# EAGLE design controller v2 (EAGLE 6.4)
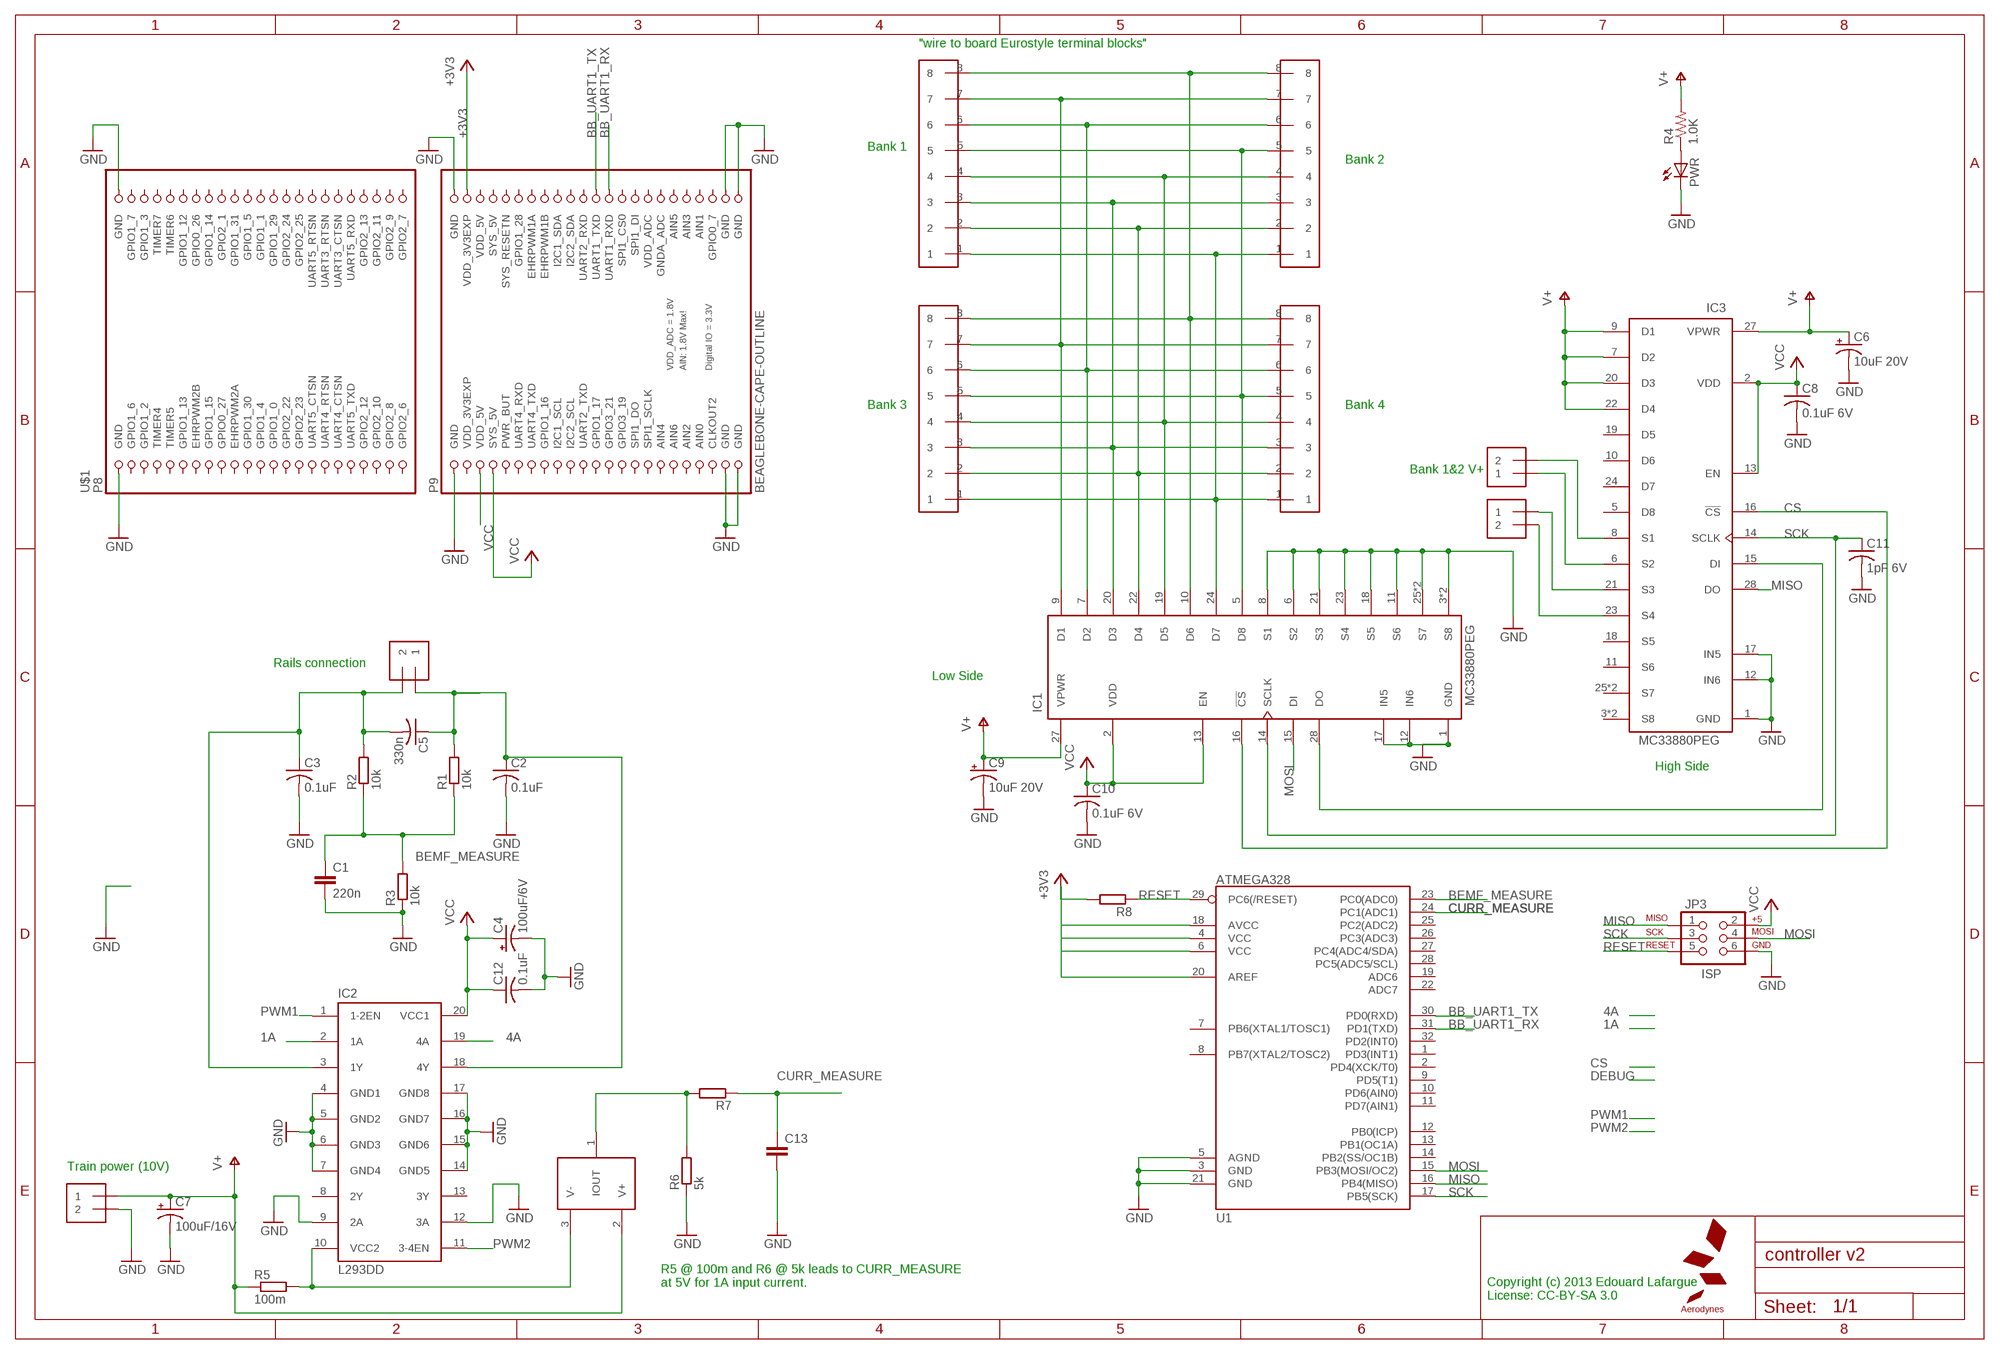
[diagram p0: schematic, sheet 1]

## Parts
BANK12  1X2-3.5MM  [1X2-3.5MM]
BANK34  1X2-3.5MM  [1X2-3.5MM]
C1  220n  C-EUC0805  [C0805]
C2  0.1uF  C-US025-025X050  [C025-025X050]
C3  0.1uF  C-US025-025X050  [C025-025X050]
C4  100uF/6V  CPOL-USE2.5-5  [E2,5-5]
C5  330n  C-US050-025X075  [C050-025X075]
C6  10uF 20V  CPOL-USE2,5-6E  [E2,5-6E]
C7  100uF/16V  CPOL-USE2.5-6  [E2,5-6]
C8  0.1uF 6V  C-US025-025X050  [C025-025X050]
C9  10uF 20V  CPOL-USE2,5-6E  [E2,5-6E]
C10  0.1uF 6V  C-US025-025X050  [C025-025X050]
C11  1pF 6V  C-USC0805K  [C0805K]
C12  0.1uF  C-US025-025X050  [C025-025X050]
C13  C-EUC0805K  [C0805K]
CON1  1X08-CONN3.5MM  [1X08-3.5MM]
CON2  1X08-CONN3.5MM  [1X08-3.5MM]
CON3  1X08-CONN3.5MM  [1X08-3.5MM]
CON4  1X08-CONN3.5MM  [1X08-3.5MM]
IC1  MC33880PEG  [SO28W]
IC2  L293DD  [SOIC20-2]
IC3  MC33880PEG  [SO28W]
JP3  ISP  AVR_SPI_PRG_6PTH  [2X3]
PWR  LED3MM  [LED3MM]
R1  10k  R-EU_R0805  [R0805]
R2  10k  R-EU_R0805  [R0805]
R3  10k  R-EU_R0805  [R0805]
R4  1.0K  R-US_M0805  [M0805]
R5  100m  R-EU_M1206  [M1206]
R6  5k  R-EU_R0603  [R0603]
R7  R-EU_R0603  [R0603]
R8  R-EU_R0603  [R0603]
SL1  1X2-3.5MM  [1X2-3.5MM]
SL2  1X2-3.5MM  [1X2-3.5MM]
U1  ATMEGA328  ATMEGA168  [TQFP32-08]
U$1  BEAGLEBONE-CAPE-OUTLINE  [BEAGLEBONE_NOCUT]
U$2  LOGO-AERODYNESSMALL  [LOGO-AERODYNES-S]
U$3  ZXCT1009-F  [SOT23-1TOP]

## Nets
1A: IC2.2(1A)
1Y: C3.1 C5.2 IC2.3(1Y) R2.2 SL1.2
4A: IC2.19(4A)
4Y: C2.1 C5.1 IC2.18(4Y) R1.2 SL1.1
+3V3: R8.2 U1.4(VCC) U1.6(VCC) U1.18(AVCC) U1.20(AREF) U$1.P9-4(VDD_3V3EXP)
BB_UART1_RX: U1.31(PD1(TXD)) U$1.P9-26(UART1_RXD)
BB_UART1_TX: U1.30(PD0(RXD)) U$1.P9-24(UART1_TXD)
BEMF_MEASURE: C1.1 R1.1 R2.1 R3.2 U1.23(PC0(ADC0))
CS: IC1.16(!CS) IC3.16(!CS)
CURR_MEASURE: C13.1 R7.1 U1.24(PC1(ADC1))
GND: C1.2 C2.2 C3.2 C4.- C6.- C7.- C8.2 C9.- C10.2 C11.2 C12.2 C13.2 IC1.1(GND) IC1.3(S8) IC1.4(S8) IC1.6(S2) IC1.8(S1) IC1.11(S6) IC1.12(IN6) IC1.17(IN5) IC1.18(S5) IC1.21(S3) IC1.23(S4) IC1.25(S7) IC1.26(S7) IC2.4(GND1) IC2.5(GND2) IC2.6(GND3) IC2.7(GND4) IC2.9(2A) IC2.12(3A) IC2.14(GND5) IC2.15(GND6) IC2.16(GND7) IC2.17(GND8) IC3.1(GND) IC3.12(IN6) IC3.17(IN5) JP3.6 PWR.K(C) R3.1 R6.1 SL2.2 U1.3(GND) U1.5(AGND) U1.21(GND) U$1.P8-1(GND) U$1.P8-2(GND) U$1.P9-1(GND) U$1.P9-2(GND) U$1.P9-43(GND) U$1.P9-44(GND) U$1.P9-45(GND) U$1.P9-46(GND)
MISO: IC3.28(DO) JP3.1 U1.16(PB4(MISO))
MOSI: IC1.15(DI) JP3.4 U1.15(PB3(MOSI/OC2))
N$1: BANK34.2 IC3.23(S4)
N$2: BANK34.1 IC3.21(S3)
N$3: BANK12.1 IC3.6(S2)
N$4: BANK12.2 IC3.8(S1)
N$5: IC2.10(VCC2) R5.2 U$3.3(V-)
N$6: R6.2 R7.2 U$3.1(IOUT)
N$7: CON1.3 CON2.3 CON3.3 CON4.3 IC1.20(D3)
N$8: CON1.4 CON2.4 CON3.4 CON4.4 IC1.19(D5)
N$9: CON1.5 CON2.5 CON3.5 CON4.5 IC1.5(D8)
N$11: CON1.1 CON2.1 CON3.1 CON4.1 IC1.24(D7)
N$12: CON1.8 CON2.8 CON3.8 CON4.8 IC1.10(D6)
N$13: IC1.28(DO) IC3.15(DI)
N$14: CON1.7 CON2.7 CON3.7 CON4.7 IC1.9(D1)
N$15: CON1.2 CON2.2 CON3.2 CON4.2 IC1.22(D4)
N$16: CON1.6 CON2.6 CON3.6 CON4.6 IC1.7(D2)
N$17: U$1.P9-5(VDD_5V)
N$35: PWR.A R4.1
PWM1: IC2.1(1-2EN)
PWM2: IC2.11(3-4EN)
RESET: JP3.5 R8.1 U1.29(PC6(/RESET))
SCK: C11.1 IC1.14(SCLK) IC3.14(SCLK) JP3.3 U1.17(PB5(SCK))
SYS_5V: C4.+ C8.1 C10.1 C12.1 IC1.2(VDD) IC1.13(EN) IC2.20(VCC1) IC3.2(VDD) IC3.13(EN) JP3.2 ; supply symbol labelled VCC
V+: C6.+ C7.+ C9.+ IC1.27(VPWR) IC3.7(D2) IC3.9(D1) IC3.20(D3) IC3.22(D4) IC3.27(VPWR) R4.2 R5.1 SL2.1 U$3.2(V+)
VCC: U$1.P9-7(SYS_5V)
Unconnected: IC2.8(2Y) IC2.13(3Y) IC3.3(S8) IC3.4(S8) IC3.5(D8) IC3.10(D6) IC3.11(S6) IC3.18(S5) IC3.19(D5) IC3.24(D7) IC3.25(S7) IC3.26(S7) U1.1(PD3(INT1)) U1.2(PD4(XCK/T0)) U1.7(PB6(XTAL1/TOSC1)) U1.8(PB7(XTAL2/TOSC2)) U1.9(PD5(T1)) U1.10(PD6(AIN0)) U1.11(PD7(AIN1)) U1.12(PB0(ICP)) U1.13(PB1(OC1A)) U1.14(PB2(SS/OC1B)) U1.19(ADC6) U1.22(ADC7) U1.25(PC2(ADC2)) U1.26(PC3(ADC3)) U1.27(PC4(ADC4/SDA)) U1.28(PC5(ADC5/SCL)) U1.32(PD2(INT0)) U$1.P8-3(GPIO1_6) U$1.P8-4(GPIO1_7) U$1.P8-5(GPIO1_2) U$1.P8-6(GPIO1_3) U$1.P8-7(TIMER4) U$1.P8-8(TIMER7) U$1.P8-9(TIMER5) U$1.P8-10(TIMER6) U$1.P8-11(GPIO1_13) U$1.P8-12(GPIO1_12) U$1.P8-13(EHRPWM2B) U$1.P8-14(GPIO0_26) U$1.P8-15(GPIO1_15) U$1.P8-16(GPIO1_14) U$1.P8-17(GPIO0_27) U$1.P8-18(GPIO2_1) U$1.P8-19(EHRPWM2A) U$1.P8-20(GPIO1_31) U$1.P8-21(GPIO1_30) U$1.P8-22(GPIO1_5) U$1.P8-23(GPIO1_4) U$1.P8-24(GPIO1_1) U$1.P8-25(GPIO1_0) U$1.P8-26(GPIO1_29) U$1.P8-27(GPIO2_22) U$1.P8-28(GPIO2_24) U$1.P8-29(GPIO2_23) U$1.P8-30(GPIO2_25) U$1.P8-31(UART5_CTSN) U$1.P8-32(UART5_RTSN) U$1.P8-33(UART4_RTSN) U$1.P8-34(UART3_RTSN) U$1.P8-35(UART4_CTSN) U$1.P8-36(UART3_CTSN) U$1.P8-37(UART5_TXD) U$1.P8-38(UART5_RXD) U$1.P8-39(GPIO2_12) U$1.P8-40(GPIO2_13) U$1.P8-41(GPIO2_10) U$1.P8-42(GPIO2_11) U$1.P8-43(GPIO2_8) U$1.P8-44(GPIO2_9) U$1.P8-45(GPIO2_6) U$1.P8-46(GPIO2_7) U$1.P9-9(PWR_BUT) U$1.P9-10(SYS_RESETN) U$1.P9-11(UART4_RXD) U$1.P9-12(GPIO1_28) U$1.P9-13(UART4_TXD) U$1.P9-14(EHRPWM1A) U$1.P9-15(GPIO1_16) U$1.P9-16(EHRPWM1B) U$1.P9-17(I2C1_SCL) U$1.P9-18(I2C1_SDA) U$1.P9-19(I2C2_SCL) U$1.P9-20(I2C2_SDA) U$1.P9-21(UART2_TXD) U$1.P9-22(UART2_RXD) U$1.P9-23(GPIO1_17) U$1.P9-25(GPIO3_21) U$1.P9-27(GPIO3_19) U$1.P9-28(SPI1_CS0) U$1.P9-29(SPI1_DO) U$1.P9-30(SPI1_DI) U$1.P9-31(SPI1_SCLK) U$1.P9-33(AIN4) U$1.P9-35(AIN6) U$1.P9-36(AIN5) U$1.P9-37(AIN2) U$1.P9-38(AIN3) U$1.P9-39(AIN0) U$1.P9-40(AIN1) U$1.P9-41(CLKOUT2) U$1.P9-42(GPIO0_7)

## Notes on the sheet
- "wire to board Eurostyle terminal blocks"
- Bank 1
- Bank 2
- Bank 3 | Bank 4
- Bank 1&2 V+
- Rails connection
- Low Side
- High Side
- Train power (10V)
- R5 @ 100m and R6 @ 5k leads to CURR_MEASURE
  at 5V for 1A input current.
- Copyright (c) 2013 Edouard Lafargue
  License: CC-BY-SA 3.0

## Power pins joined to a net without a drawn wire
GNDA_ADC: U$1.P9-34(GNDA_ADC)
SYS_5V: U$1.P9-8(SYS_5V)
VDD_3V3EXP: U$1.P9-3(VDD_3V3EXP)
VDD_5V: U$1.P9-6(VDD_5V)
VDD_ADC: U$1.P9-32(VDD_ADC)

## Library data of the parts
BANK12 BANK34 SL1 SL2 = adafruit:1X2: 3.5mm Terminal block http://www.ladyada.net/library/pcb/eaglelibrary.html
C1 C13 = resistor:C-EU: CAPACITOR, European symbol
C2 C3 C8 C10-C12 = rcl-ez:C-US: CAPACITOR, American symbol
C4 = adafruit:CPOL-US: POLARIZED CAPACITOR, American symbol
C5 = adafruit:C-US: CAPACITOR, American symbol
C6 C9 = rcl:CPOL-US: POLARIZED CAPACITOR, American symbol
C7 = rcl-ez:CPOL-US: POLARIZED CAPACITOR, American symbol
CON1-CON4 = aerodynes:1X08-CONN: Generic 3.5mm pitch screw connector, 8 plots.
IC1 IC3 = aerodynes:MC33880: Freescale 33880 The 33880 device is an 8-output hardware configurable high side/ low side switch with 8-bit serial input control using the serial peripheral interface (SPI). Two of the outputs can be controlled directly via microcontroller for pulse-width modulation (PWM) applications. The 33880 controls various inductive or incandescent loads by directly interfacing with a microcontroller. The circuit's innovative monitoring and protection features include very low standby currents, “cascadable” fault reporting, internal 40 V output clamping for low side configurations, internal -20 V output clamping for high side configurations, output specific diagnostics, and independent shutdown of outputs.
IC2 = aerodynes:L293D: The Device is a monolithic integrated high voltage, high current four channel driver designed to accept standard DTL or TTL logic levels and drive inductive loads (such as relays solenoides, DC and stepping motors) and switching power transistors. To simplify use as two bridges each pair of channels is equipped with an enable input. A separate supply input is provided for the logic, allowing operation at a lower voltage and internal clamp diodes are included. This device is suitable for use in switching applications at frequencies up to 5 kHz.
JP3 = SparkFun:AVR_SPI_PRG_6: AVR ISP 6 Pin This is the reduced ISP connector for AVR programming. Common on Arduino. This footprint will take up less PCB space and can be used with a 10-pin to 6-pin adapter such as SKU: BOB-08508
PWR = minimidi:LED: LED OSRAM: - CHIPLED LG R971, LG N971, LY N971, LG Q971, LY Q971, LO R971, LY R971 LH N974, LH R974 LS Q976, LO Q976, LY Q976 LO Q996 - Hyper CHIPLED LW Q18S LB Q993, LB Q99A, LB R99A - SideLED LS A670, LO A670, LY A670, LG A670, LP A670 LB A673, LV A673, LT A673, LW A673 LH A674 LY A675 LS A676, LA A676, LO A676, LY A676, LW A676 LS A679, LY A679, LG A679 - Hyper Micro SIDELED® LS Y876, LA Y876, LO Y876, LY Y876 LT Y87S - SmartLED LW L88C, LW L88S LB L89C, LB L89S, LG L890 LS L89K, LO L89K, LY L89K LS L896, LA L896, LO L896, LY L896 - TOPLED LS T670, LO T670, LY T670, LG T670, LP T670 LSG T670, LSP T670, LSY T670, LOP T670, LYG T670 LG T671, LOG T671, LSG T671 LB T673, LV T673, LT T673, LW T673 LH T674 LS T676, LA T676, LO T676, LY T676, LB T676, LH T676, LSB T676, LW T676 LB T67C, LV T67C, LT T67C, LS T67K, LO T67K, LY T67K, LW E67C LS E67B, LA E67B, LO E67B, LY E67B, LB E67C, LV E67C, LT E67C LW T67C LS T679, LY T679, LG T679 LS T770, LO T770, LY T770, LG T770, LP T770 LB T773, LV T773, LT T773, LW T773 LH T774 LS E675, LA E675, LY E675, LS T675 LS T776, LA T776, LO T776, LY T776, LB T776 LHGB T686 LT T68C, LB T68C - Hyper Mini TOPLED® LB M676 - Mini TOPLED Santana® LG M470 LS M47K, LO M47K, LY M47K Source: http://www.osram.convergy.de/
R1-R3 R5-R8 = resistor:R-EU_: RESISTOR, European symbol
R4 = rcl-ez:R-US_: RESISTOR, American symbol
U1 = SparkFun:ATMEGA168
U$1 = aerodynes:BEAGLEBONE-CAPE
U$2 = aerodynes:LOGO-AERODYNES
U$3 = aerodynes:ZXCT1009: The ZXCT1009 is a high side current sense monitor. Using this device eliminates the need to disrupt the ground plane when sensing a load current. It takes a high side voltage developed across a current shunt resistor and translates it into a proportional output current. A user defined output resistor scales the output current into a ground-referenced voltage. The wide input voltage range of 20V down to as low as 2.5V make it suitable for a range of applications. A minimum operating current of just 4µA, combined with a SOT23 package make it a unique solution for portable battery equipment. The SM8 device offers an alternative package option. http://www.diodes.com/datasheets/ZXCT1009.pdf

## Net classes
0 Default: width 0.254 mm
1 power: width 0.61 mm

## Board
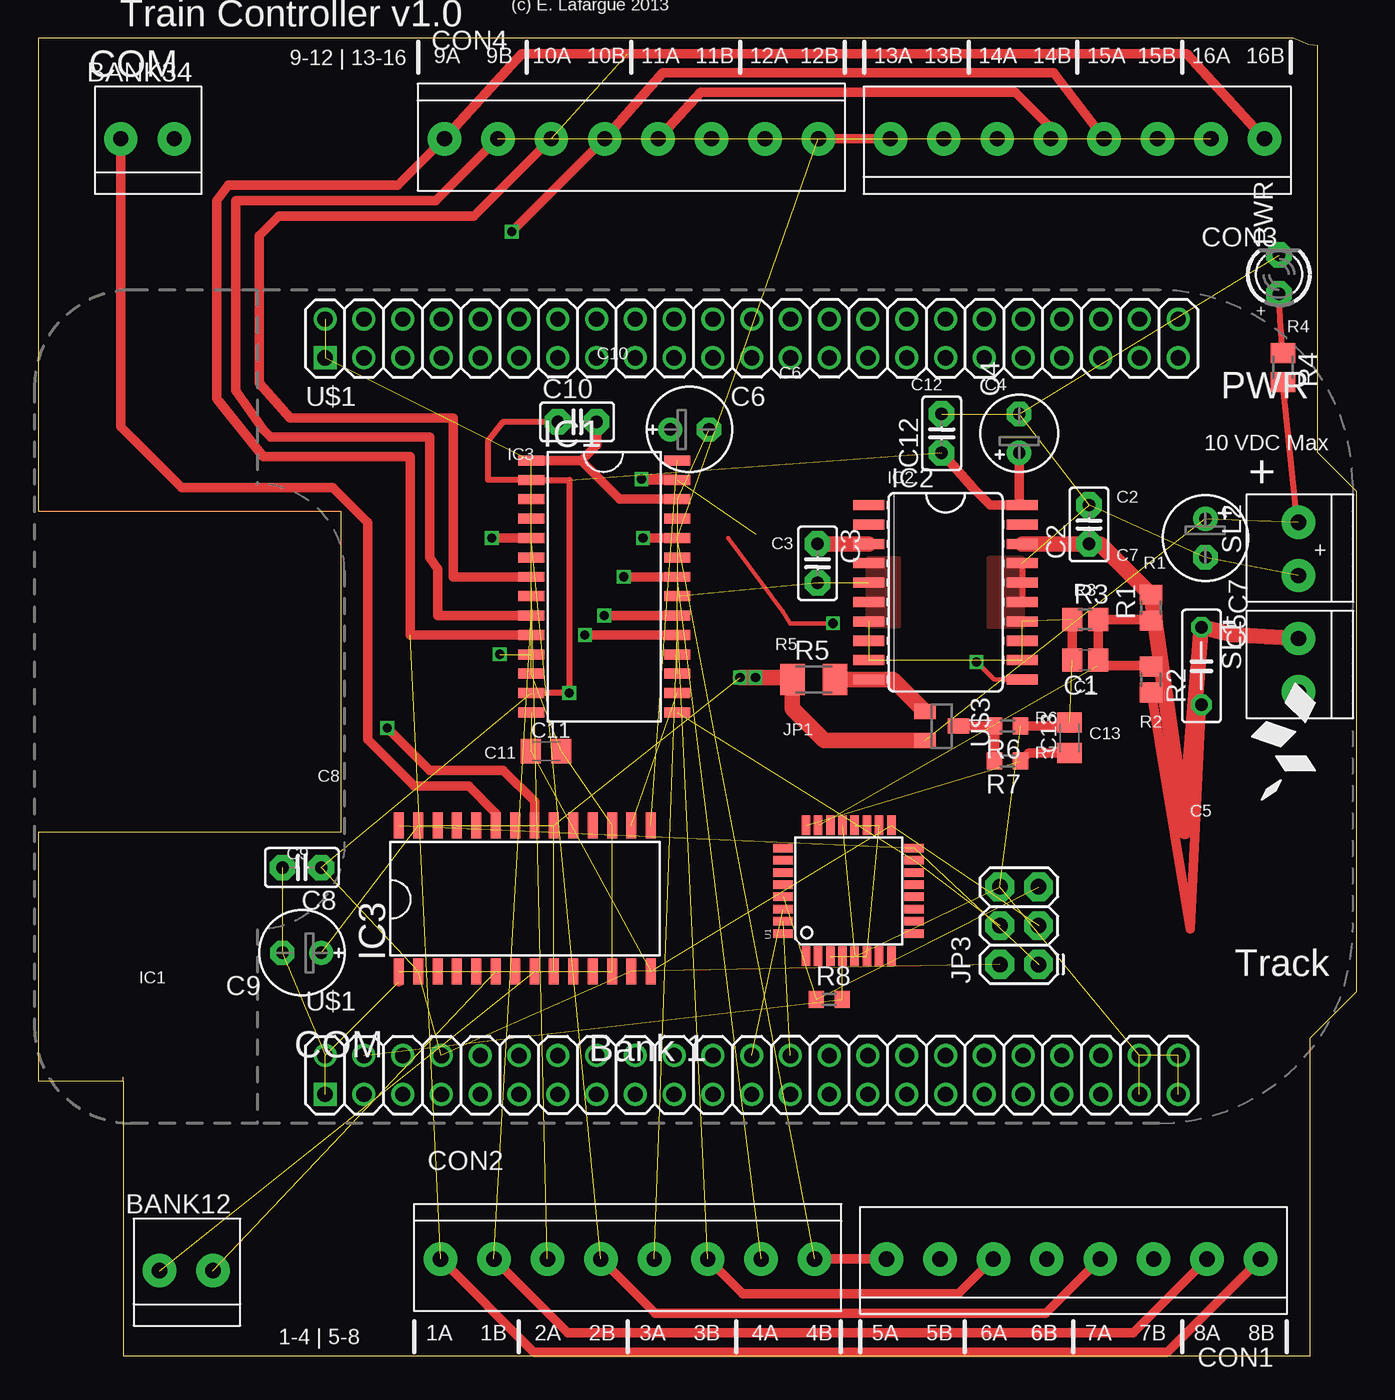
[diagram p1: board, top side]
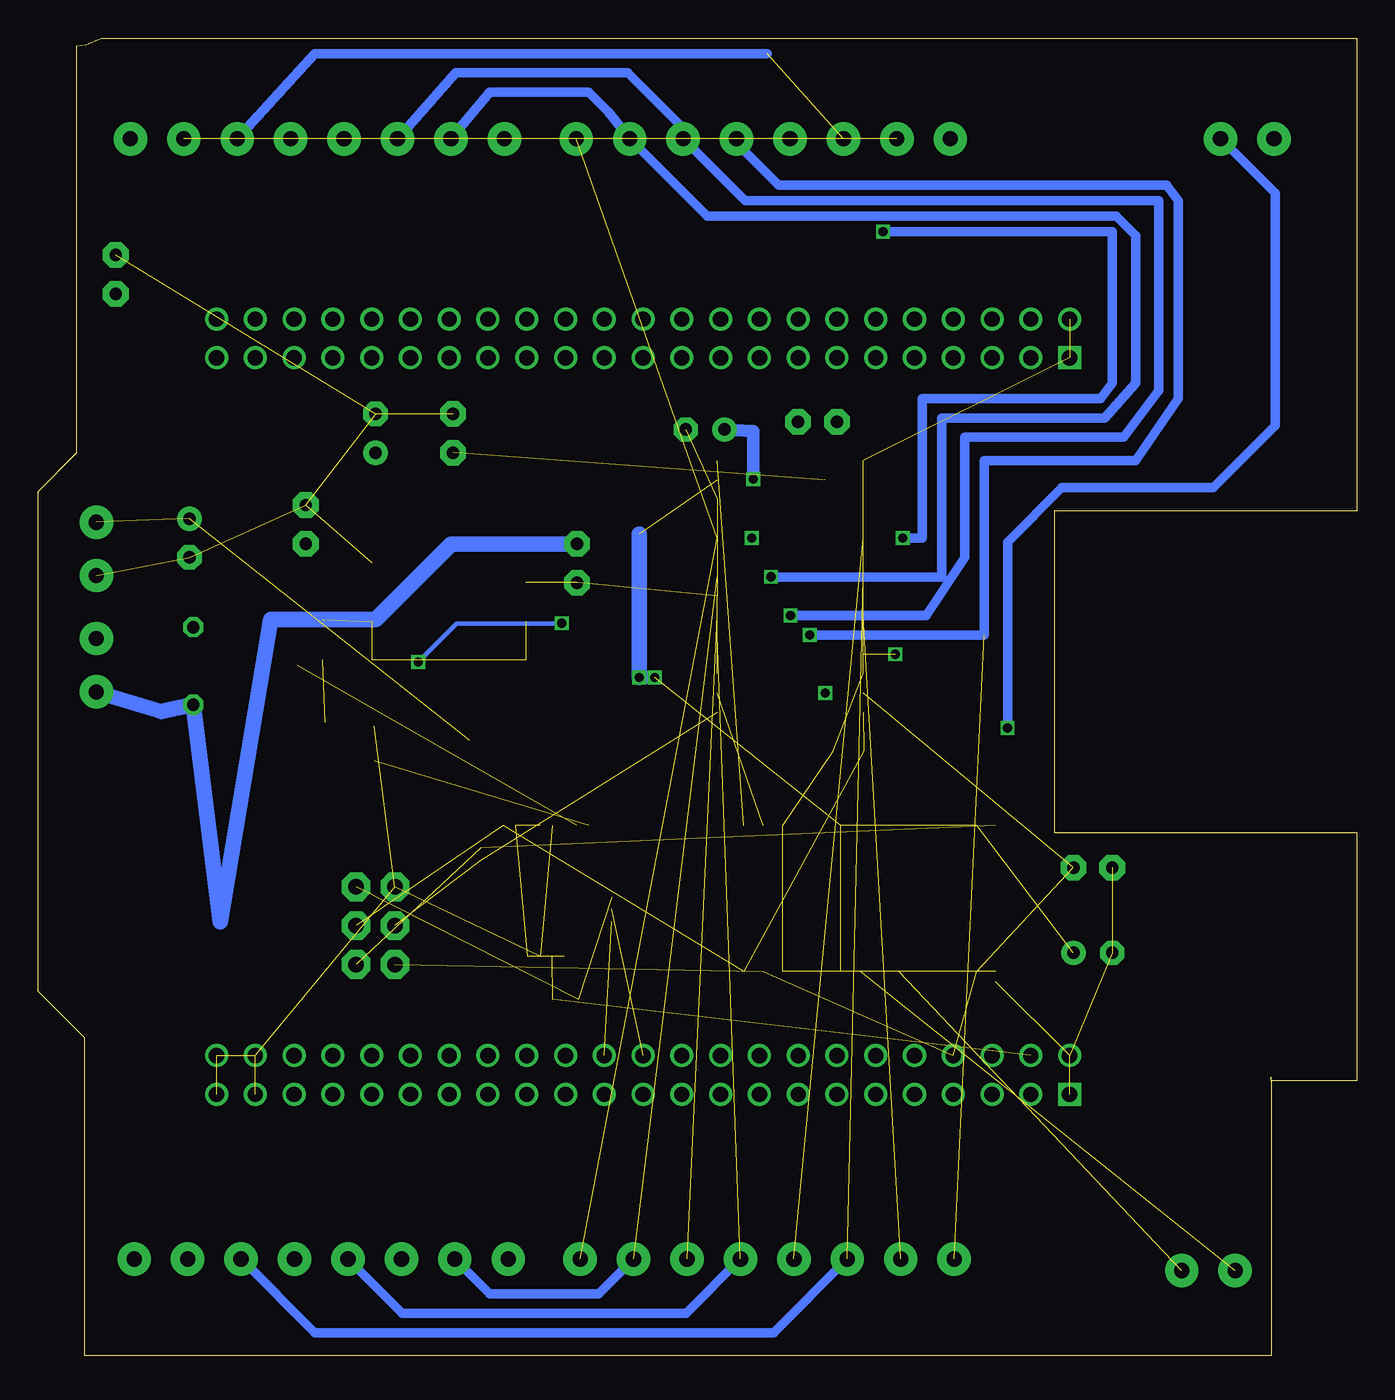
[diagram p2: board, bottom side, seen from below]

Size 86.36 x 86.35 mm. Coordinates in mm from the lower left corner, seen from the top.
Outline: 5.59,18.03 0,18.03 0,34.29 19.81,34.29 19.81,55.37 0,55.37 0,86.35 82.22,86.35 83.24,85.93 83.82,85.85 83.82,59.18 86.36,56.64 86.36,23.88 83.31,20.83 83.31,0 5.59,0 5.59,18.03
Outline: 5.59,18.03 5.59,18.29
Copper layers (1*16): Top 0.035mm / dielectric 1.5mm / Bottom 0.035mm
Design rules "Fusion_eagle_rule_v1.1": minimum track width 6mil, minimum drill 12mil, track to track 6mil, track to pad 6mil, pad to pad 6mil, via to via 6mil, smd to smd 0mil, copper to edge 10mil, drill to drill 10mil, minimum pad ring 10mil, minimum via ring 6mil, stop-mask expansion 2mil, vias tented up to drill 100mil, thermal gap 10mil

### Footprints (pad centres in the part's own frame; a part is rotated, then mirrored left to right if it is on the bottom)
1X2-3.5MM = drill 1 pad 2.184: 1 1.8,0; 2 -1.7,0
C0805 = smd 1.3 x 1.5: 1 -0.85,0; 2 0.85,0
C025-025X050 = drill 0.813 pad 1.676 octagon: 1 -1.27,0; 2 1.27,0
E2,5-5 = drill 0.813 pad 1.6: + -1.27,0 | drill 0.813 pad 1.6 octagon: - 1.27,0
C050-025X075 = drill 0.813 octagon: 1 -2.54,0; 2 2.54,0
E2,5-6E = drill 0.813 pad 1.575: + -1.27,0 | drill 0.813 pad 1.575 octagon: - 1.27,0
E2,5-6 = drill 0.813 pad 1.6: + -1.27,0 | drill 0.813 pad 1.6 octagon: - 1.27,0
C0805K = smd 1.3 x 1.6: 1 -1,0; 2 1,0
1X08-3.5MM = drill 1 pad 2.184: 1 -12.25,0; 2 -8.75,0; 3 -5.25,0; 4 -1.75,0; 5 1.75,0; 6 5.25,0; 7 8.75,0; 8 12.25,0
SO28W = smd 0.65 x 1.7: 1 -11.43,-3.51; 2 -10.16,-3.51; 3 -8.89,-3.51; 4 -7.62,-3.51; 5 -6.35,-3.51; 6 -5.08,-3.51; 7 -3.81,-3.51; 8 -2.54,-3.51; 9 -1.27,-3.51; 10 0,-3.51; 11 1.27,-3.51; 12 2.54,-3.51; 13 3.81,-3.51; 14 5.08,-3.51; 15 5.08,6.05; 16 3.81,6.05; 17 2.54,6.05; 18 1.27,6.05; 19 0,6.05; 20 -1.27,6.05; 21 -2.54,6.05; 22 -3.81,6.05; 23 -5.08,6.05; 24 -6.35,6.05; 25 -7.62,6.05; 26 -8.89,6.05; 27 -10.16,6.05; 28 -11.43,6.05
SOIC20-2 = smd 0.66 x 2.032: 1 -5.715,-5.029; 2 -4.445,-5.029; 3 -3.175,-5.029; 4 -1.905,-5.029; 5 -0.635,-5.029; 6 0.635,-5.029; 7 1.905,-5.029; 8 3.175,-5.029; 9 4.445,-5.029; 10 5.715,-5.029; 11 5.715,5.029; 12 4.445,5.029; 13 3.175,5.029; 14 1.905,5.029; 15 0.635,5.029; 16 -0.635,5.029; 17 -1.905,5.029; 18 -3.175,5.029; 19 -4.445,5.029; 20 -5.715,5.029
2X3 = drill 1.016 pad 1.88 octagon: 1 0,0; 2 0,2.54; 3 2.54,0; 4 2.54,2.54; 5 5.08,0; 6 5.08,2.54
LED3MM = drill 0.813 pad 1.676 octagon: A -1.27,0; K 1.27,0
R0805 = smd 1.3 x 1.5: 1 -0.85,0; 2 0.85,0
M0805 = smd 1.3 x 1.6: 1 -0.95,0; 2 0.95,0
M1206 = smd 1.6 x 2: 1 -1.4,0; 2 1.4,0
R0603 = smd 1 x 1.1: 1 -0.85,0; 2 0.85,0
TQFP32-08 = smd 1.27 x 0.559: 1 -4.293,2.8; 2 -4.293,2; 3 -4.293,1.2; 4 -4.293,0.4; 5 -4.293,-0.4; 6 -4.293,-1.2; 7 -4.293,-2; 8 -4.293,-2.8; 17 4.293,-2.8; 18 4.293,-2; 19 4.293,-1.2; 20 4.293,-0.4; 21 4.293,0.4; 22 4.293,1.2; 23 4.293,2; 24 4.293,2.8 | smd 0.559 x 1.27: 9 -2.8,-4.293; 10 -2,-4.293; 11 -1.2,-4.293; 12 -0.4,-4.293; 13 0.4,-4.293; 14 1.2,-4.293; 15 2,-4.293; 16 2.8,-4.293; 25 2.8,4.293; 26 2,4.293; 27 1.2,4.293; 28 0.4,4.293; 29 -0.4,4.293; 30 -1.2,4.293; 31 -2,4.293; 32 -2.8,4.293
BEAGLEBONE_NOCUT = drill 1 square: P8-1 19.05,50.165; P9-1 19.05,1.905 | drill 1: P8-2 19.05,52.705; P8-3 21.59,50.165; P8-4 21.59,52.705; P8-5 24.13,50.165; P8-6 24.13,52.705; P8-7 26.67,50.165; P8-8 26.67,52.705; P8-9 29.21,50.165; P8-10 29.21,52.705; P8-11 31.75,50.165; P8-12 31.75,52.705; P8-13 34.29,50.165; P8-14 34.29,52.705; P8-15 36.83,50.165; P8-16 36.83,52.705; P8-17 39.37,50.165; P8-18 39.37,52.705; P8-19 41.91,50.165; P8-20 41.91,52.705; P8-21 44.45,50.165; P8-22 44.45,52.705; P8-23 46.99,50.165; P8-24 46.99,52.705; P8-25 49.53,50.165; P8-26 49.53,52.705; P8-27 52.07,50.165; P8-28 52.07,52.705; P8-29 54.61,50.165; P8-30 54.61,52.705; P8-31 57.15,50.165; P8-32 57.15,52.705; P8-33 59.69,50.165; P8-34 59.69,52.705; P8-35 62.23,50.165; P8-36 62.23,52.705; P8-37 64.77,50.165; P8-38 64.77,52.705; P8-39 67.31,50.165; P8-40 67.31,52.705; P8-41 69.85,50.165; P8-42 69.85,52.705; P8-43 72.39,50.165; P8-44 72.39,52.705; P8-45 74.93,50.165; P8-46 74.93,52.705; P9-2 19.05,4.445; P9-3 21.59,1.905; P9-4 21.59,4.445; P9-5 24.13,1.905; P9-6 24.13,4.445; P9-7 26.67,1.905; P9-8 26.67,4.445; P9-9 29.21,1.905; P9-10 29.21,4.445; P9-11 31.75,1.905; P9-12 31.75,4.445; P9-13 34.29,1.905; P9-14 34.29,4.445; P9-15 36.83,1.905; P9-16 36.83,4.445; P9-17 39.37,1.905; P9-18 39.37,4.445; P9-19 41.91,1.905; P9-20 41.91,4.445; P9-21 44.45,1.905; P9-22 44.45,4.445; P9-23 46.99,1.905; P9-24 46.99,4.445; P9-25 49.53,1.905; P9-26 49.53,4.445; P9-27 52.07,1.905; P9-28 52.07,4.445; P9-29 54.61,1.905; P9-30 54.61,4.445; P9-31 57.15,1.905; P9-32 57.15,4.445; P9-33 59.69,1.905; P9-34 59.69,4.445; P9-35 62.23,1.905; P9-36 62.23,4.445; P9-37 64.77,1.905; P9-38 64.77,4.445; P9-39 67.31,1.905; P9-40 67.31,4.445; P9-41 69.85,1.905; P9-42 69.85,4.445; P9-43 72.39,1.905; P9-44 72.39,4.445; P9-45 74.93,1.905; P9-46 74.93,4.445
SOT23-1TOP = smd 1 x 1.4: 1 0,1.1; 2 0.95,-1.1; 3 -0.95,-1.1

### Placement (x,y rotation side)
BANK12  9.65,5.59 0 top
BANK34  7.11,79.76 0 top
C1  68.58,45.59 180 top
C2  68.83,54.48 90 top
C3  51.05,51.94 270 top
C4  64.26,60.45 90 top
C5  76.2,45.21 270 top
C6  42.67,60.71 0 top
C7  76.45,53.59 270 top
C8  17.27,32 180 top
C9  17.27,26.42 180 top
C10  35.31,61.21 0 top
C11  33.27,39.62 0 top
C12  59.18,60.45 90 top
C13  67.56,40.51 90 top
CON1  67.82,6.35 0 top
CON2  38.61,6.35 180 top
CON3  68.07,79.76 0 top
CON4  38.86,79.76 180 top
IC1  35.81,47.24 270 top
IC2  59.44,50.04 270 top
IC3  35.05,28.7 0 top
JP3  65.53,25.65 90 top
PWR  81.28,70.87 90 top
R1  72.9,49.02 90 top
R2  72.9,44.32 270 top
R3  68.58,48.26 0 top
R4  81.53,64.77 270 top
R5  50.8,44.32 0 top
R6  63.5,41.27 180 top
R7  63.5,38.99 180 top
R8  51.82,23.37 0 top
SL1  82.55,45.21 90 top
SL2  82.55,52.83 90 top
U1  53.09,30.48 90 top
U$1  -0.25,15.24 0 top
U$2  82.04,40.89 0 top
U$3  59.18,41.27 270 top

### Tracks (layer width: path | path; a pad name or v marks a point on that pad's centre or on a via)
1Y
  Top 0.61: R2.2 75.48,27.98 C5.2
  Top 1.016: IC2.3 C3.1
  Bottom 1.016: C3.1 59.31,53.21 64.26,48.26 71.12,48.26 74.42,28.45 C5.2 78.31,42.24 SL1.2
4Y
  Top 1.016: SL1.1 78.21,47.27 C5.1 75.1,34.38 R1.2 69.56,53.21 C2.1 IC2.18
+3V3  (5 unrouted)
BB_UART1_RX  (1 unrouted)
BB_UART1_TX  (1 unrouted)
BEMF_MEASURE  (1 unrouted)
  Top 0.61: R1.1 72.81,48.26 R3.2 C1.1 69.39,45.25 72.82,45.25 R2.1
CS  (1 unrouted)
CURR_MEASURE  (1 unrouted)
  Top 0.61: C13.1 64.87,39.51 R7.1
GND  (via drill 0.6)  (44 unrouted)
  Top 0.406: IC2.17 IC2.16 IC2.15
  Top 0.61: IC1.1 35.56,58.67 | R3.1 C1.2 | R6.1 67.33,41.27 C13.2 | 23.62,24.51 IC3.1 | 35.56,58.67 36.58,59.69 C10.2 | IC1.26 38.1,56.13 35.56,58.67
  other vias: 30.23,45.97
  pour Top (isolate 0.254, rank 2, no thermals): 54.36,47.81 54.36,52.27 56.39,52.27 56.39,47.81
  pour Top (isolate 0.254, rank 2, no thermals): 64.52,47.81 64.52,52.27 62.23,52.27 62.23,47.81
MISO  (2 unrouted)
MOSI  (2 unrouted)
N$1
  Top 0.61: IC3.23 29.97,35.56 28.19,37.34 24.64,37.34 21.59,40.39 21.59,54.61 19.3,56.9 9.4,56.9 5.41,60.88 BANK34.2
N$2  (via drill 0.6)
  Top 0.61: IC3.21 32.51,36.32 30.48,38.35 25.65,38.35 v22.86,41.15
  Bottom 0.61: v22.86,41.15 22.86,53.34 19.3,56.9 9.4,56.9 5.33,60.96 5.33,76.18 BANK34.1
N$3  (1 unrouted)
N$4  (1 unrouted)
N$5
  Top 1.016: IC2.10 R5.2 55.98,44.32 U$3.3
N$6
  Top 0.61: U$3.1 R6.2 R7.2
N$7  (via drill 0.6)  (1 unrouted)
  Top 0.61: v37.08,48.51 IC1.20 | CON2.3 46.14,4.06 60.28,4.06 CON1.3
  Bottom 0.61: CON4.3 44.11,80.43 47.75,84.07 59.01,84.07 CON3.3 | CON4.3 44.11,79.67 | v37.08,48.51 28.19,48.51 25.65,52.32 25.65,60.2 15.24,60.2 12.95,63.25 12.95,75.69 40.05,75.69 CON4.3
N$8  (via drill 0.6)  (1 unrouted)
  Top 0.61: 66.32,80.49 64.01,82.8 43.41,82.8 CON4.4 | v35.81,47.24 IC1.19
  Top 0.813: CON3.4 66.32,80.49
  Bottom 0.61: CON4.4 40.39,79.76 40.39,79.25 37.85,76.71 12.45,76.71 11.68,75.69 11.68,62.74 14.48,58.67 24.38,58.67 24.38,47.24 v35.81,47.24 | CON2.4 43.91,2.79 62.51,2.79 CON1.4
N$9  (via drill 0.6)  (1 unrouted)
  Top 0.61: CON3.5 66.52,84.07 40.92,84.07 CON4.5 v31.02,73.66 | v29.72,53.59 IC1.5 | CON2.5 40.41,2.79 66.01,2.79 CON1.5
  Bottom 0.61: v31.02,73.66 16,73.66 16,63.75 16.76,62.74 28.45,62.74 28.45,53.59 v29.72,53.59
N$11  (via drill 0.6)  (2 unrouted)
  Top 0.61: CON4.1 CON3.1 | CON2.1 CON1.1 | v39.62,53.59 IC1.24
N$12  (1 unrouted)
  Top 0.61: CON3.8 75.24,85.34 31.69,85.34 CON4.8 23.56,76.71 12.45,76.71 11.68,75.69 11.68,62.74 14.73,58.93 24.38,58.93 24.38,47.24 IC1.10 | CON2.8 32.45,0.25 73.97,0.25 CON1.8
N$13  (1 unrouted)
N$14  (2 unrouted)
  Top 0.61: IC1.9 26.16,48.51 26.16,51.56 25.65,52.32 25.65,60.2 15.24,60.2 14.73,60.71 12.95,63.25 12.95,75.69 26.05,75.69 CON4.7 | CON2.7 34.68,1.52 71.74,1.52 CON1.7
N$15  (via drill 0.6)  (1 unrouted)
  Top 0.61: v38.35,51.05 IC1.22
  Bottom 0.61: CON4.2 49.02,81.53 50.29,82.8 56.78,82.8 CON3.2 | CON4.2 47.61,80.38 | CON4.2 47.5,79.76 | v38.35,51.05 27.18,51.05 27.18,61.47 16.51,61.47 14.48,63.75 14.48,73.41 15.75,74.68 42.53,74.68 CON4.2 | CON2.2 49.64,4.06 56.78,4.06 CON1.2
N$16  (2 unrouted)
  Top 0.61: IC1.7 27.18,51.05 27.18,61.47 16.51,61.47 14.48,63.75 14.48,73.41 15.75,74.68 28.53,74.68 CON4.6
  Bottom 0.61: 38.61,85.34 68.24,85.34 CON3.6 | CON2.6 38.18,1.52 68.24,1.52 CON1.6
N$35
  Top 0.406: R4.1 81.35,67.88 PWR.A
PWM2  (via drill 0.6)
  Top 0.305: 45.21,53.59 48.77,48.77 49.28,48.01 v52.07,48.01 | v61.47,45.47 62.61,44.32 IC2.11
  Bottom 0.305: v52.07,48.01 58.93,48.01 v61.47,45.47
RESET  (2 unrouted)
SCK  (4 unrouted)
SYS_5V  (via drill 0.6)  (6 unrouted)
  Top 0.406: IC1.13 v34.8,43.43 34.8,57.4 IC1.2 29.46,57.4 29.46,59.94 30.48,61.21 C10.1
  Top 0.61: C12.1 61.21,56.9 62.36,55.75 IC2.20 64.26,55.98 C4.+
V+  (via drill 0.6)  (9 unrouted)
  Top 0.406: SL2.1 82.55,54.04 R4.2 | 46.74,44.2 v46.99,44.45
  Top 0.61: v39.52,57.45 39.62,57.4 IC1.27 41.81,57.45 v39.52,57.45
  Top 1.016: U$3.2 51.5,40.32 49.4,42.42 R5.1 49.27,44.45 v46.99,44.45 v45.97,44.45
  Bottom 0.61: 39.57,57.4 v39.52,57.45
  Bottom 0.813: C6.+ 39.52,60.6 v39.52,57.45 | v45.97,44.45 v46.99,44.45
  Bottom 1.016: v46.99,44.45 46.99,53.85

### Text on the board
tPlace: (c) E. Lafargue 2013 | Train Controller v1.0 | 9-12 | 13-16 | 9A | 9B | 10A | 10B | 11A | 11B | 12A | 12B | 13A | 13B | 14A | 14B | 15A | 15B | 16A | 16B | COM | + | R4 | C10 | C6 | C12 | C4 | PWR | 10 VDC Max | IC3 | IC2 | + | C2 | C3 | C7 | + | R1 | R3 | - | R5 | C1 | R6 | R2 | JP1 | C13 | C11 | R7 | C8 | C5 | C9 | IC1 | Track | COM | Bank 1 | 1A | 1B | 2A | 2B | 3A | 3B | 4A | 4B | 5A | 5B | 6A | 6B | 6B | 7A | 7B | 8A | 8B | 1-4 | 5-8